# Altium project PDB.PrjPcb
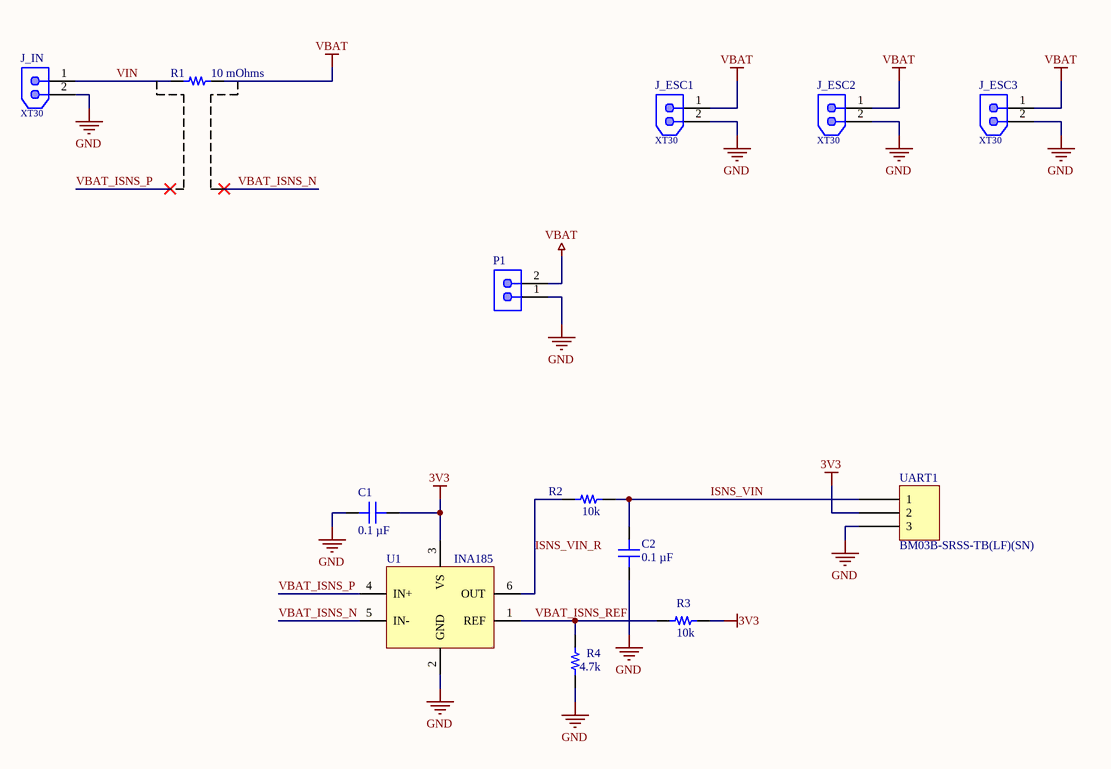
[diagram p0: Top.SchDoc]
ProjectRevision: 2.0
1 sheet, 13 parts. Net scope: global (net labels, ports and power ports of the same name join across sheets).
Board file: PDB.PcbDoc

## Sheet Top.SchDoc
size B; DocumentNumber: 1; SheetNumber: 1; SheetTotal: 1

### Parts
C1  0.1 µF  [CAP 0402_1005]
C2  0.1 µF  [CAP 0402_1005]
J_ESC1  XT30  [XT30]
J_ESC2  XT30  [XT30]
J_ESC3  XT30  [XT30]
J_IN  XT30  [XT30]
P1  2 pin 2mm JST Male  [2pin - 2mm JST male]  (value not drawn)
R1  10 mOhms  [RES 1206_3216]
R2  10k  [RES_0402]
R3  10k  [RES_0402]
R4  4.7k  [RES_0402]
U1  INA185  [TI SC70-6 DCK]
UART1  BM03B-SRSS-TB(LF)(SN)  [JST BM03B-SRSS-TB]

### Nets
3V3: C1.1 R3.1 U1.3(VS) UART1.2
GND: C1.2 C2.2 J_ESC1.2 J_ESC2.2 J_ESC3.2 J_IN.2 P1.1 R4.2 U1.2(GND) UART1.3
VBAT: J_ESC1.1 J_ESC2.1 J_ESC3.1 P1.2 R1.2
ISNS_VIN: C2.1 R2.1 UART1.1
ISNS_VIN_R: R2.2 U1.6(OUT)
VBAT_ISNS_N: U1.5(IN-)
VBAT_ISNS_P: U1.4(IN+)
VBAT_ISNS_REF: R3.2 R4.1 U1.1(REF)
VIN: J_IN.1 R1.1

### Library data of the parts
C1 C2 = C0402C104K4RACAUTO: CAP CER 0.1UF 16V X7R 0402; manufacturer: KEMET; Tolerance: ±10%; Part Number: C0402C104K4RACAUTO; Value: 0.1 µF; Applications: Automotive, Bypass, Decoupling; Capacitance: 0.1 µF; componentlink1description: Datasheet; componentlink1url: https://api.kemet.com/component-edge/download/specsheet/C0402C104K4RACAUTO.pdf; componentlink2description: DigiKey Link; componentlink2url: https://www.digikey.com/en/products/detail/kemet/C0402C104K4RACAUTO/3314827; Device Package: 0402 (1005 Metric); lastupdated: 2/9/2024 8:04:35 PM; Lifecycle Status: Active; Minimum Order: 1; Mounting Type: Surface Mount, MLCC; Operating Temperature: -55°C ~ 125°C; Package / Case: 0402 (1005 Metric); packaging: TapeAndReel; partid: 3024; Part Status: Active; price: 0.01; Ratings: AEC-Q200; series: SMD Auto X7R; Size / Dimension: 0.039" L x 0.020" W (1.00mm x 0.50mm); Supplier 1: DigiKey; Supplier Part Number 1: 399-6828-1-ND; Temperature Coefficient: X7R; Thickness (Max): 0.022" (0.55mm); Voltage - Rated: 16V
R1 = KRL1632E-M-R039-F-T5: RES 0.039 OHM 1% 3/4W 1206; Manufacturer: Susumu; Power (Watts): 0.75W, 3/4W; Resistance: 39 mOhms; Temperature Coefficient: ±50ppm/°C; Value: 39 mOhms; Part Number: KRL1632E-M-R039-F-T5; ComponentLink1Description: Datasheet; ComponentLink1URL: http://www.susumu.co.jp/common/pdf/n_catalog_partition09_en.pdf; ComponentLink2Description: DigiKey Link; ComponentLink2URL: https://www.digikey.com/en/products/detail/susumu/KRL1632E-M-R039-F-T5/3738003; Composition: Metal Foil; Device Package: 1206 (3216 Metric); Features: Automotive AEC-Q200, Current Sense; Height - Seated (Max): 0.028" (0.70mm); LastUpdated: 2/9/2024 8:54:46 PM; Lifecycle Status: Active; Minimum Order: 1; Number of Terminations: 2; Operating Temperature: -55°C ~ 155°C; Package / Case: 1206 (3216 Metric); Packaging: TapeAndReel; PartId: 26838; Part Status: Active; Price: 0.09; Ratings: AEC-Q200; Series: KRL; Size / Dimension: 0.126" L x 0.063" W (3.20mm x 1.60mm); Supplier 1: DigiKey; Supplier Part Number 1: 408-1577-1-ND; Supplier Device Package: 1206; Tolerance: ±1%
R2-R4 = RES_0402: RES 0402
U1 = INA185: INA185A2
UART1 = BM03B-SRSS-TB(LF)(SN): CONN HEADER SMD 3POS 1MM; Manufacturer: JST Sales America Inc.; Current Rating (Amps): 0.7A; Material Flammability Rating: UL94 V-0; Number of Positions: 3; Number of Positions Loaded: All; Pitch - Mating: 0.039" (1.00mm); Shrouding: Shrouded - 4 Wall; Style: Board to Cable/Wire; Voltage Rating: 50V; Part Number: BM03B-SRSS-TB(LF)(SN); ComponentLink1Description: Datasheet; ComponentLink1URL: http://www.jst-mfg.com/product/pdf/eng/eSR.pdf; ComponentLink2Description: DigiKey Link; ComponentLink2URL: http://digikey.com/product-detail/en/jst-sales-america-inc/BM03B-SRSS-TB-LF-SN/455-1789-1-ND/926860; Connector Type: Header; Contact Finish - Mating: Tin; Contact Finish - Post: Tin; Contact Material: Copper Alloy; Contact Shape: Square; Contact Type: Male Pin; Fastening Type: Push-Pull; Features: Solder Retention; Insulation Color: Natural; Insulation Height: 0.167" (4.25mm); Insulation Material: Polyamide (PA), Nylon; LastUpdated: 1/12/2020 10:12:14 PM; Lifecycle Status: Active; Minimum Order: 1; Mounting Type: Surface Mount; Number of Rows: 1; Operating Temperature: -25°C ~ 85°C; Packaging: TapeAndReel; PartId: 14; Part Status: Active; Price: 0.24; Series: SR; Supplier 1: DigiKey; Supplier Part Number 1: 455-1789-1-ND; Termination: Solder

## Assembly variants
Main: all parts fitted